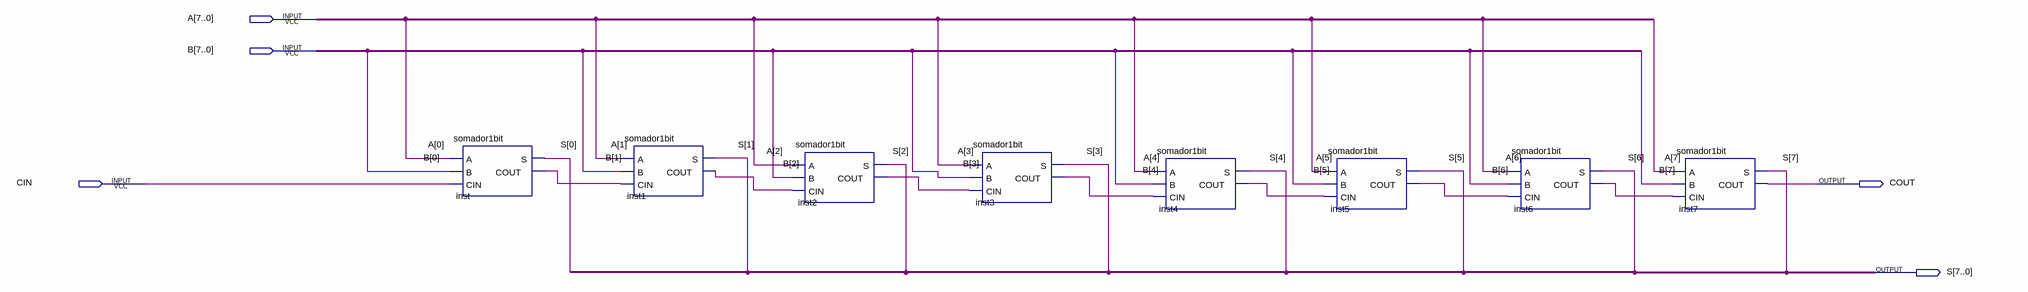
[diagram p0: schematic sheet]
// Quartus schematic somador8bit.bdf as structural Verilog: 8 symbols, 5 pins
module somador8bit (
  input  [7:0] A,
  input  [7:0] B,
  input  CIN,
  output COUT,
  output [7:0] S
);

  wire inst1_cout, inst2_cout, inst3_cout, inst4_cout, inst5_cout, inst6_cout, inst_cout;

  somador1bit inst (.A(A[0]), .B(B[0]), .CIN(CIN), .S(S[0]), .COUT(inst_cout));
  somador1bit inst1 (.A(A[1]), .B(B[1]), .CIN(inst_cout), .S(S[1]), .COUT(inst1_cout));
  somador1bit inst2 (.A(A[2]), .B(B[2]), .CIN(inst1_cout), .S(S[2]), .COUT(inst2_cout));
  somador1bit inst3 (.A(A[3]), .B(B[3]), .CIN(inst2_cout), .S(S[3]), .COUT(inst3_cout));
  somador1bit inst4 (.A(A[4]), .B(B[4]), .CIN(inst3_cout), .S(S[4]), .COUT(inst4_cout));
  somador1bit inst5 (.A(A[5]), .B(B[5]), .CIN(inst4_cout), .S(S[5]), .COUT(inst5_cout));
  somador1bit inst6 (.A(A[6]), .B(B[6]), .CIN(inst5_cout), .S(S[6]), .COUT(inst6_cout));
  somador1bit inst7 (.A(A[7]), .B(B[7]), .CIN(inst6_cout), .S(S[7]), .COUT(COUT));
endmodule
